# Altium schematic sheet Micro.SchDoc
size A4
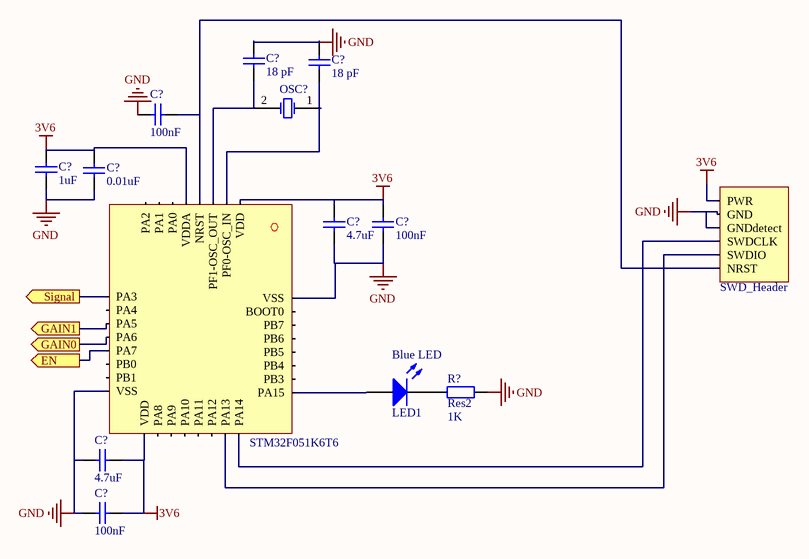
[diagram p0: Micro.SchDoc]

## Parts
(Parts that share a designator on the sheet are numbered #1, #2 ... from top to bottom, then left to right.)
*?#1  SWD_Header  [Male_header]
*?#2  STM32F051K6T6  [TQFP68P900X900X160-32N]
Blue_LED  LED1  [3.2X1.6X1.1]
C?#1  value 18 pF  [RAD-0.3]  (hidden comment: Cap)
C?#2  value 18 pF  [RAD-0.3]  (hidden comment: Cap)
C?#3  value 100nF  [RAD-0.3]  (hidden comment: Cap)
C?#4  value 1uF  [RAD-0.3]  (hidden comment: Cap)
C?#5  value 0.01uF  [RAD-0.3]  (hidden comment: Cap)
C?#6  value 4.7uF  [RAD-0.3]  (hidden comment: Cap)
C?#7  value 100nF  [RAD-0.3]  (hidden comment: Cap)
C?#8  value 4.7uF  [RAD-0.3]  (hidden comment: Cap)
C?#9  value 100nF  [RAD-0.3]  (hidden comment: Cap)
OSC?  ABMM2-14.7456MHZ-E2-T  [R38]  (value not drawn)
R?  Res2  value 1K  [AXIAL-0.4]

## Ports
EN (out), GAIN0 (out), GAIN1 (out), Signal (out)

## Nets
3V6: *?#1.1(PWR) *?#2.1(VDD) *?#2.5(VDDA) *?#2.17(VDD) C?#4.1 C?#5.1 C?#6.1 C?#7.1 C?#8.1 C?#9.1
GND: *?#1.2(GND) *?#1.3(GNDdetect) *?#2.16(VSS) *?#2.32(VSS) C?#1.2 C?#2.2 C?#3.1 C?#4.2 C?#5.2 C?#6.2 C?#7.2 C?#8.2 C?#9.2 R?.2
EN: *?#2.13(PA7) ; port EN
GAIN0: *?#2.12(PA6) ; port GAIN0
GAIN1: *?#2.11(PA5) ; port GAIN1
Signal: *?#2.9(PA3) ; port Signal
Net*?#1_4: *?#1.4(SWDCLK) *?#2.24(PA14)
Net*?#1_5: *?#1.5(SWDIO) *?#2.23(PA13)
Net*?#1_6: *?#1.6(NRST) *?#2.4(NRST) C?#3.2
Net*?#2_2: *?#2.2(PF0-OSC_IN) C?#2.1 OSC?.1(OSC1)
Net*?#2_3: *?#2.3(PF1-OSC_OUT) C?#1.1 OSC?.2(OSC2)
Net*?#2_25: *?#2.25(PA15) Blue_LED.1(A)
NetBlue_LED_2: Blue_LED.2(K) R?.1

Not connected (* = marked no-connect by the designer): *?#2 6(PA0) 7(PA1) 8(PA2) 10(PA4) 14(PB0) 15(PB1) 18(PA8) 19(PA9) 20(PA10) 21(PA11) 22(PA12) 26(PB3) 27(PB4) 28(PB5) 29(PB6) 30(PB7) 31(BOOT0)

## Library data of the parts
Blue_LED = LED2: Typical RED, GREEN, YELLOW, AMBER GaAs LED; Published: 8-Jun-2000; LatestRevisionDate: 17-Jul-2002; LatestRevisionNote: Re-released for DXP Platform.; PackageVersion: Feb-2002; PackageReference: 3.2X1.6X1.1; Publisher: Altium Limited; PackageDescription: SM LED; 2 Flat Leads
C?#1-C?#9 = Cap: Capacitor; Published: 8-Jun-2000; LatestRevisionDate: 17-Jul-2002; LatestRevisionNote: Re-released for DXP Platform.; PackageReference: RAD-0.3; Publisher: Altium Limited; PackageDescription: Radial Cap, Thru-Hole; 2 Leads; 0.3 in Pin Spacing
OSC? = XTAL: Crystal Oscillator; Published: 8-Jun-2000; LatestRevisionDate: 17-Jul-2002; LatestRevisionNote: Re-released for DXP Platform.; PackageReference: R38; Publisher: Altium Limited; PackageDescription: Crystal, Thru-Hole; 2 Leads; Body 3.1 x 8.2 mm (Dia.xH)
R? = Res2: Resistor; Published: 8-Jun-2000; LatestRevisionDate: 17-Jul-2002; LatestRevisionNote: Re-released for DXP Platform.; PackageReference: AXIAL-0.4; Publisher: Altium Limited; PackageDescription: Axial Device, Thru-Hole; 2 Leads; 0.4 in Pin Spacing
*?#2 = STM32F051K6T6: Supplier 1: Mouser; Supplier Part Number 1: 511-STM32F051K6T6